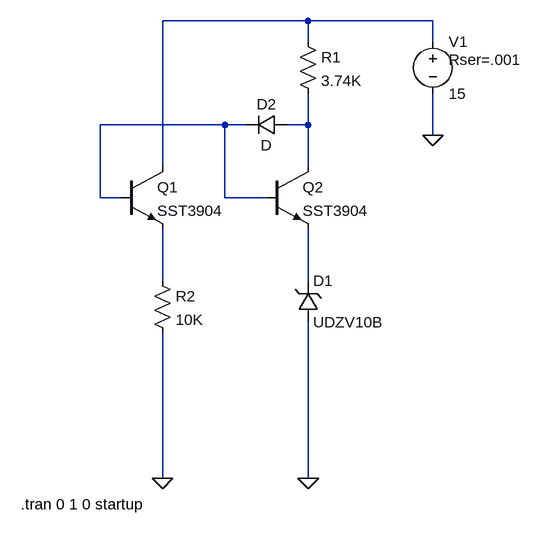
[diagram p0: schematic vref.asc]
vref.asc, the LTspice schematic file:
Version 4
SHEET 1 880 680
WIRE 544 -128 320 -128
WIRE 736 -128 544 -128
WIRE 544 -96 544 -128
WIRE 736 -96 736 -128
WIRE 416 32 224 32
WIRE 448 32 416 32
WIRE 544 32 544 -16
WIRE 544 32 512 32
WIRE 736 48 736 -16
WIRE 320 96 320 -128
WIRE 544 96 544 32
WIRE 224 144 224 32
WIRE 256 144 224 144
WIRE 416 144 416 32
WIRE 480 144 416 144
WIRE 320 272 320 192
WIRE 544 272 544 192
WIRE 320 576 320 352
WIRE 544 576 544 336
FLAG 544 576 0
FLAG 736 48 0
FLAG 320 576 0
SYMBOL zener 528 336 M180
WINDOW 0 24 64 Left 2
WINDOW 3 24 0 Left 2
SYMATTR InstName D1
SYMATTR Value UDZV10B
SYMATTR Description Diode
SYMATTR Type diode
SYMBOL npn 256 96 R0
SYMATTR InstName Q1
SYMATTR Value SST3904
SYMBOL npn 480 96 R0
SYMATTR InstName Q2
SYMATTR Value SST3904
SYMBOL res 528 -112 R0
SYMATTR InstName R1
SYMATTR Value 3.74K
SYMATTR SpiceLine tol=1 pwr=0.1
SYMBOL voltage 736 -112 R0
WINDOW 123 0 0 Left 2
WINDOW 39 24 44 Left 2
SYMATTR InstName V1
SYMATTR Value 15
SYMATTR SpiceLine Rser=.001
SYMBOL res 304 256 R0
SYMATTR InstName R2
SYMATTR Value 10K
SYMATTR SpiceLine tol=1 pwr=0.1
SYMBOL diode 512 16 R90
WINDOW 0 0 32 VBottom 2
WINDOW 3 32 32 VTop 2
SYMATTR InstName D2
TEXT 102 616 Left 2 !.tran 0 1 0 startup

The netlist it stands for:
* vref.asc
D1 0 N005 UDZV10B
Q1 N001 N002 N004 0 SST3904
Q2 N003 N002 N005 0 SST3904
R1 N001 N003 3.74K tol=1 pwr=0.1
V1 N001 0 15 Rser=.001
R2 N004 0 10K tol=1 pwr=0.1
D2 N003 N002 D
.model D D
.lib standard.dio
.model NPN NPN
.model PNP PNP
.lib standard.bjt
.tran 0 1 0 startup
.backanno
.end